# EAGLE schematic screw-back-single-a-2 (EAGLE 9.6.2)
AUTHOR: Balazs Racz; DRAWING_TITLE: MEB Schalterwerk Projekt; LICENSE: Licensed by the Solderpad Hardware License V2.0; REVIEWER: n/a; REVISION: A5; YEAR: 2023
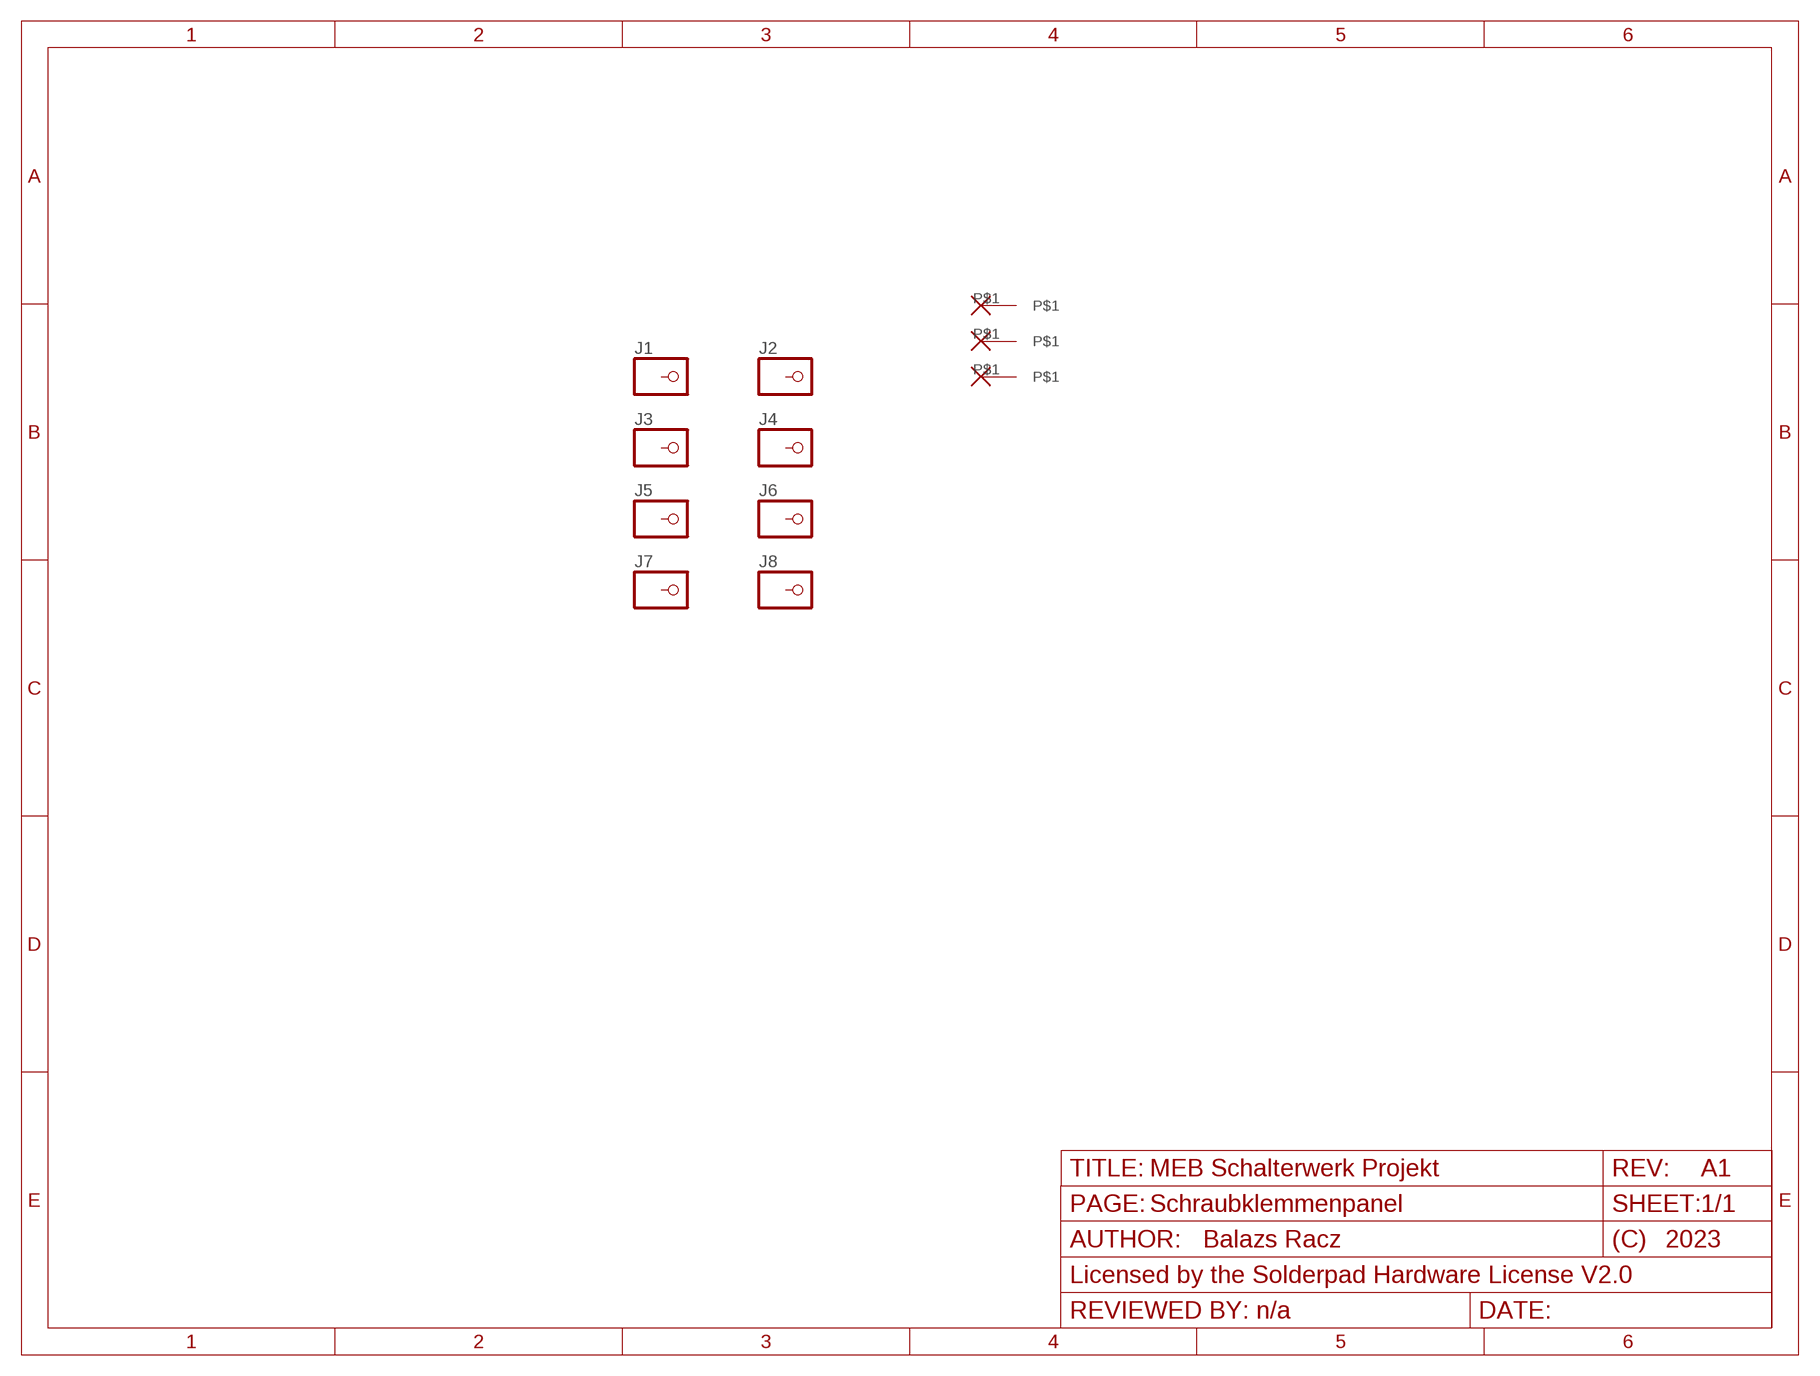
[diagram p0: schematic, sheet 1]
FRAME1 (FRAME_A_L): PAGE: Input ports
FRAME2 (FRAME_A_L): PAGE: Schraubklemmenpanel; REVISION: A1

## Parts
H5  ALIGN-HOLE  [ALIGNMENT-HOLE]
H6  ALIGN-HOLE  [ALIGNMENT-HOLE]
H7  ALIGN-HOLE  [ALIGNMENT-HOLE]
J1  M4-SCREW-HOLEHEAD  [M4-SCREW-HEAD]
J2  M4-SCREW-HOLEHEAD  [M4-SCREW-HEAD]
J3  M4-SCREW-HOLEHEAD  [M4-SCREW-HEAD]
J4  M4-SCREW-HOLEHEAD  [M4-SCREW-HEAD]
J5  M4-SCREW-HOLEHEAD  [M4-SCREW-HEAD]
J6  M4-SCREW-HOLEHEAD  [M4-SCREW-HEAD]
J7  M4-SCREW-HOLEHEAD  [M4-SCREW-HEAD]
J8  M4-SCREW-HOLEHEAD  [M4-SCREW-HEAD]
Unconnected: H5.P$1 H6.P$1 H7.P$1 J1.P$1 J1.P$2 J2.P$1 J2.P$2 J3.P$1 J3.P$2 J4.P$1 J4.P$2 J5.P$1 J5.P$2 J6.P$1 J6.P$2 J7.P$1 J7.P$2 J8.P$1 J8.P$2

## Library data of the parts
H5-H7 = eagleparts:ALIGN-HOLE
J1-J8 = eagleparts:M4-SCREW-HOLE